# Altium project ECP5_V2.PrjPcb (part 1 of 2)
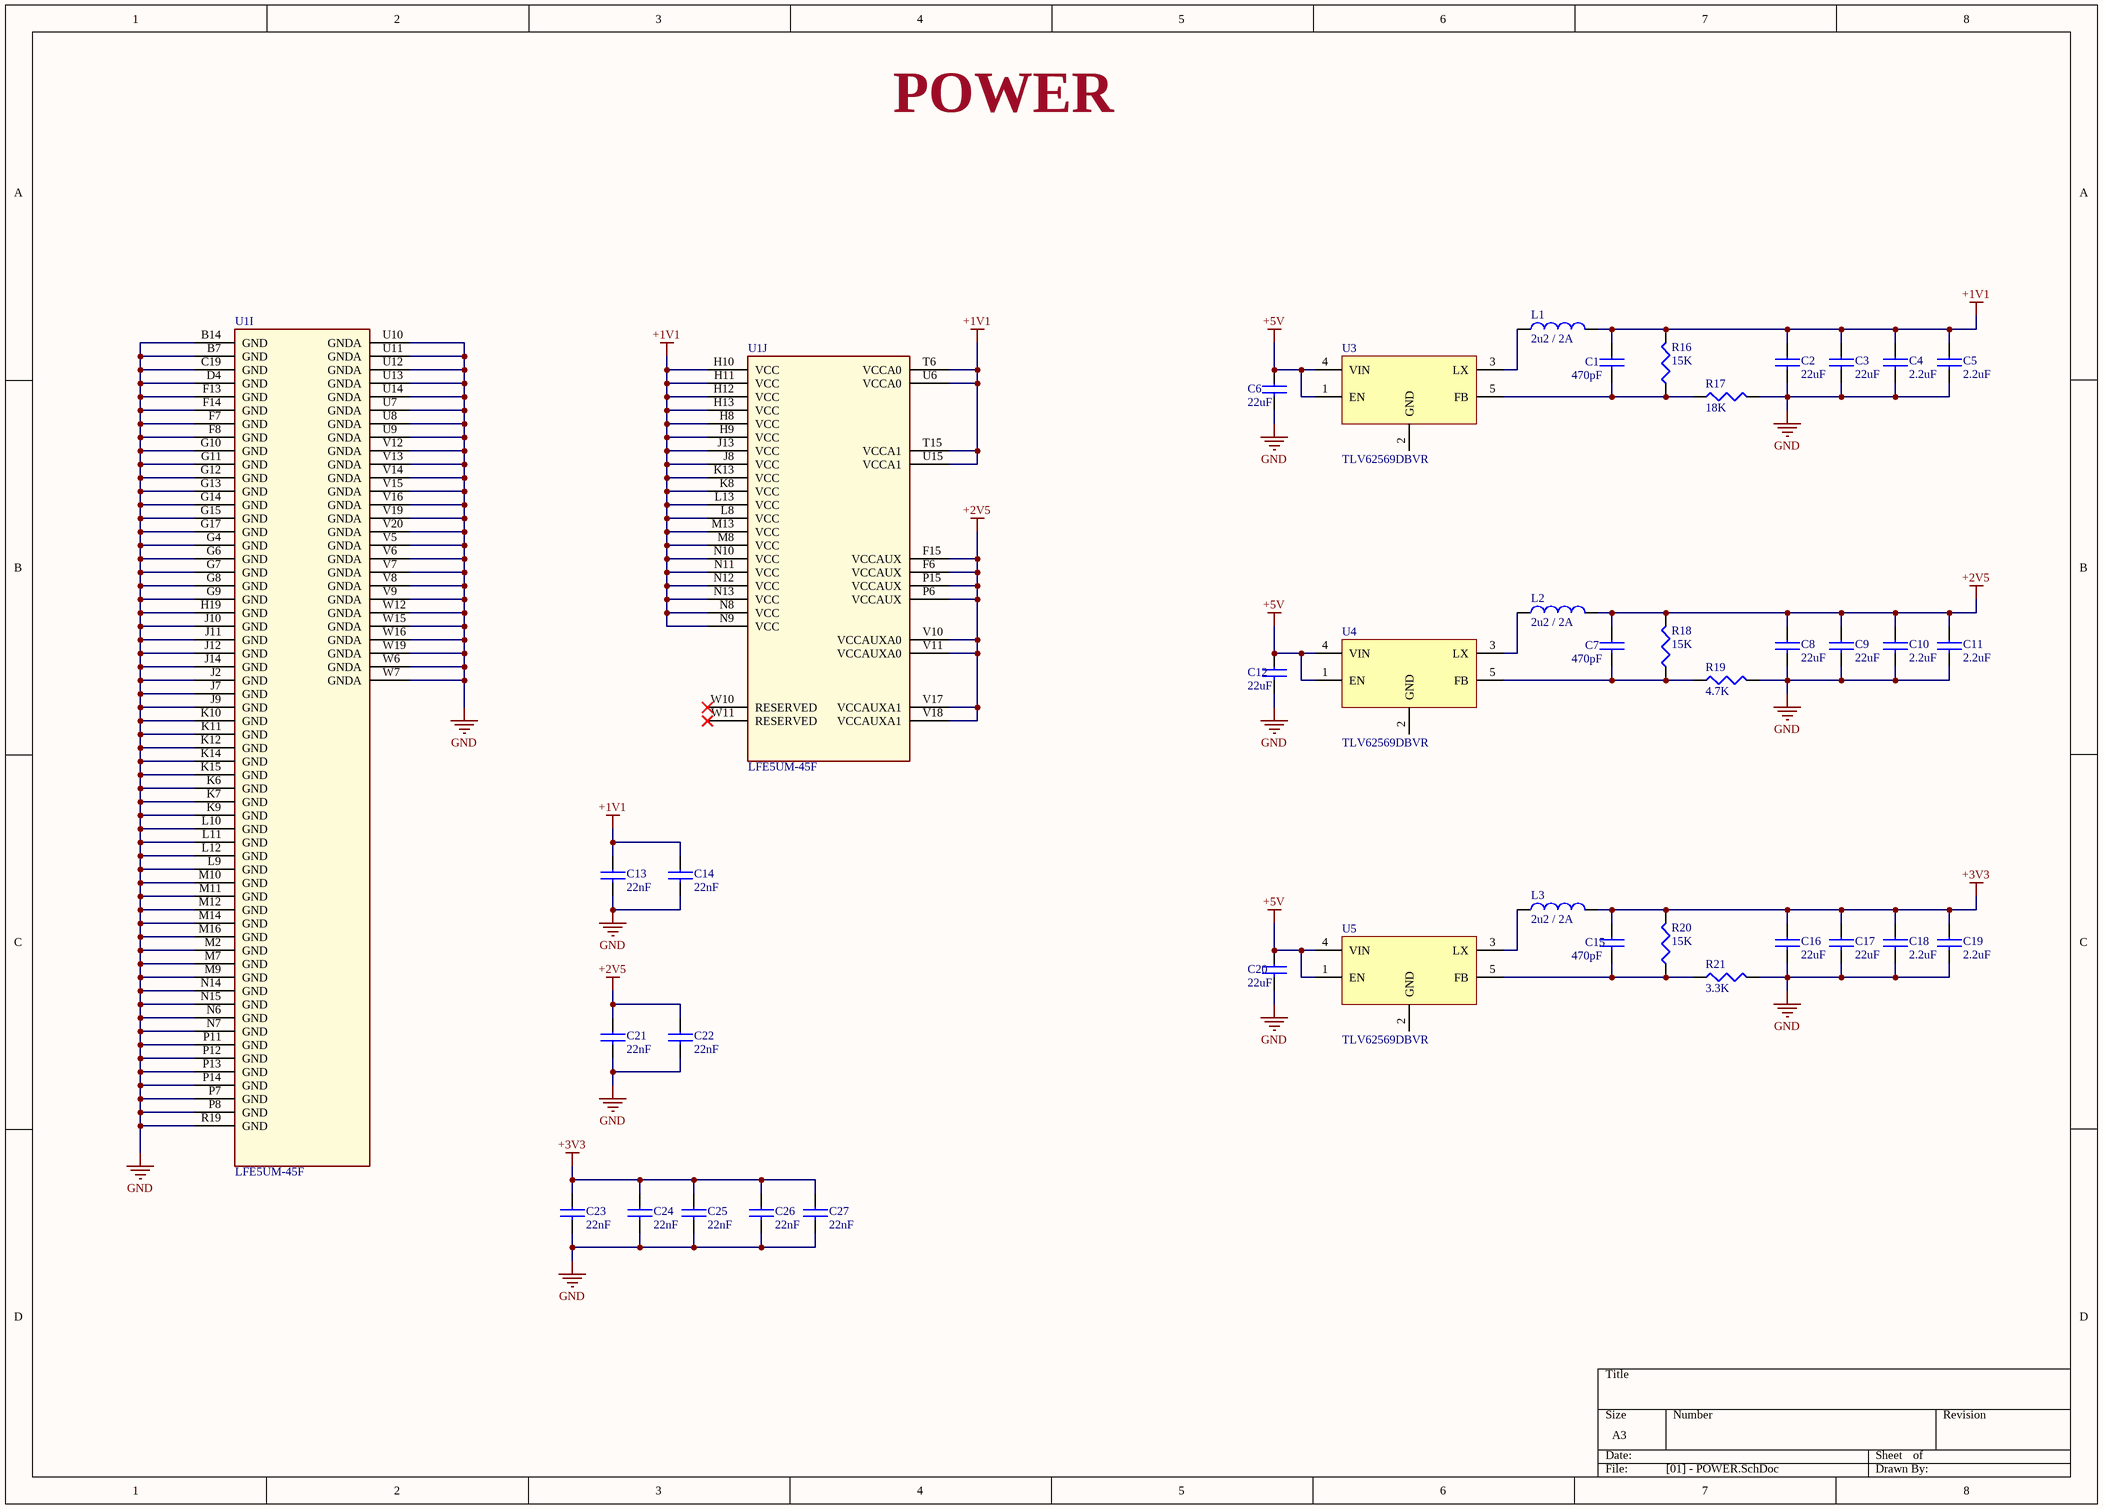
[diagram p0: [01] - POWER.SchDoc]
7 sheets, 98 parts. Net scope: global (net labels, ports and power ports of the same name join across sheets).
Board file: ECP5_V2.PcbDoc
Sheets:
  [01] - POWER.SchDoc
  [02] - USB.SchDoc
  [03] - SDCARD.SchDoc
  [04] - RAM.SchDoc
  [05] - FLASH.SchDoc
  [06] - GPIO.SchDoc
  [07] - UNUSED.SchDoc

## Sheet [01] - POWER.SchDoc
size A3

### Parts
C1  470pF  [C0603]
C2  22uF  [C0805]
C3  22uF  [C0805]
C4  2.2uF  [C0805]
C5  2.2uF  [C0805]
C6  22uF  [C0805]
C7  470pF  [C0603]
C8  22uF  [C0805]
C9  22uF  [C0805]
C10  2.2uF  [C0805]
C11  2.2uF  [C0805]
C12  22uF  [C0805]
C13  22nF  [C0603]
C14  22nF  [C0603]
C15  470pF  [C0603]
C16  22uF  [C0805]
C17  22uF  [C0805]
C18  2.2uF  [C0805]
C19  2.2uF  [C0805]
C20  22uF  [C0805]
C21  22nF  [C0603]
C22  22nF  [C0603]
C23  22nF  [C0603]
C24  22nF  [C0603]
C25  22nF  [C0603]
C26  22nF  [C0603]
C27  22nF  [C0603]
L1  2u2 / 2A  [C1210_IND]
L2  2u2 / 2A  [C1210_IND]
L3  2u2 / 2A  [C1210_IND]
R16  15K  [R0603]
R17  18K  [R0603]
R18  15K  [R0603]
R19  4.7K  [R0603]
R20  15K  [R0603]
R21  3.3K  [R0603]
U1  LFE5UM-45F  [LFE5BG381]  (parts I,J of 11)
U3  TLV62569DBVR  [SOT95P370X145-5N]
U4  TLV62569DBVR  [SOT95P370X145-5N]
U5  TLV62569DBVR  [SOT95P370X145-5N]

### Nets
+1V1: C1.1 C2.1 C3.1 C4.1 C5.1 C13.1 C14.1 L1.2 R16.2 U1.H8(VCC) U1.H9(VCC) U1.H10(VCC) U1.H11(VCC) U1.H12(VCC) U1.H13(VCC) U1.J8(VCC) U1.J13(VCC) U1.K8(VCC) U1.K13(VCC) U1.L8(VCC) U1.L13(VCC) U1.M8(VCC) U1.M13(VCC) U1.N8(VCC) U1.N9(VCC) U1.N10(VCC) U1.N11(VCC) U1.N12(VCC) U1.N13(VCC) U1.T6(VCCA0) U1.T15(VCCA1) U1.U6(VCCA0) U1.U15(VCCA1)
+2V5: C7.1 C8.1 C9.1 C10.1 C11.1 C21.1 C22.1 L2.2 R18.2 U1.F6(VCCAUX) U1.F15(VCCAUX) U1.P6(VCCAUX) U1.P15(VCCAUX) U1.V10(VCCAUXA0) U1.V11(VCCAUXA0) U1.V17(VCCAUXA1) U1.V18(VCCAUXA1)
+3V3: C15.1 C16.1 C17.1 C18.1 C19.1 C23.1 C24.1 C25.1 C26.1 C27.1 L3.2 R20.2
+5V: C6.1 C12.1 C20.1 U3.1(EN) U3.4(VIN) U4.1(EN) U4.4(VIN) U5.1(EN) U5.4(VIN)
GND: C2.2 C3.2 C4.2 C5.2 C6.2 C8.2 C9.2 C10.2 C11.2 C12.2 C13.2 C14.2 C16.2 C17.2 C18.2 C19.2 C20.2 C21.2 C22.2 C23.2 C24.2 C25.2 C26.2 C27.2 R17.2 R19.2 R21.2 U1.B7(GND) U1.B14(GND) U1.C19(GND) U1.D4(GND) U1.F7(GND) U1.F8(GND) U1.F13(GND) U1.F14(GND) U1.G4(GND) U1.G6(GND) U1.G7(GND) U1.G8(GND) U1.G9(GND) U1.G10(GND) U1.G11(GND) U1.G12(GND) U1.G13(GND) U1.G14(GND) U1.G15(GND) U1.G17(GND) U1.H19(GND) U1.J2(GND) U1.J7(GND) U1.J9(GND) U1.J10(GND) U1.J11(GND) U1.J12(GND) U1.J14(GND) U1.K6(GND) U1.K7(GND) U1.K9(GND) U1.K10(GND) U1.K11(GND) U1.K12(GND) U1.K14(GND) U1.K15(GND) U1.L9(GND) U1.L10(GND) U1.L11(GND) U1.L12(GND) U1.M2(GND) U1.M7(GND) U1.M9(GND) U1.M10(GND) U1.M11(GND) U1.M12(GND) U1.M14(GND) U1.M16(GND) U1.N6(GND) U1.N7(GND) U1.N14(GND) U1.N15(GND) U1.P7(GND) U1.P8(GND) U1.P11(GND) U1.P12(GND) U1.P13(GND) U1.P14(GND) U1.R19(GND) U1.U7(GNDA) U1.U8(GNDA) U1.U9(GNDA) U1.U10(GNDA) U1.U11(GNDA) U1.U12(GNDA) U1.U13(GNDA) U1.U14(GNDA) U1.V5(GNDA) U1.V6(GNDA) U1.V7(GNDA) U1.V8(GNDA) U1.V9(GNDA) U1.V12(GNDA) U1.V13(GNDA) U1.V14(GNDA) U1.V15(GNDA) U1.V16(GNDA) U1.V19(GNDA) U1.V20(GNDA) U1.W6(GNDA) U1.W7(GNDA) U1.W12(GNDA) U1.W15(GNDA) U1.W16(GNDA) U1.W19(GNDA)
NetC1_2: C1.2 R16.1 R17.1 U3.5(FB)
NetC7_2: C7.2 R18.1 R19.1 U4.5(FB)
NetC15_2: C15.2 R20.1 R21.1 U5.5(FB)
NetL1_1: L1.1 U3.3(LX)
NetL2_1: L2.1 U4.3(LX)
NetL3_1: L3.1 U5.3(LX)

Not connected (* = marked no-connect by the designer): U1 W10(RESERVED)* W11(RESERVED)*; U3 2(GND); U4 2(GND); U5 2(GND)

### Notes on the sheet
- POWER

### Library data of the parts
C1 C7 C15 = C0603C471K3RACTU: KEMET - C0603C471K3RACTU - SMD Multilayer Ceramic Capacitor, 470 pF, 25 V, 0603 [1608 Metric], ± 10%, X7R, C Series KEMET; Voltage Rating: 25V; Supplier 1: Digi-Key; Manufacturer: KEMET; Manufacturer Part Number: C0603C471K3RACTU; Stock 1: 28906; Pricing 1: 1=0.1, 10=0.067, 100=0.0298, 500=0.02126, 1000=0.0167 (USD); Mount: Surface Mount; Case/Package: 0603; Case Code (Metric): 1608; Case Code (Imperial): 0603; Dielectric Material: Ceramic; Min Operating Temperature: -55°C; Max Operating Temperature: 125°C; Package Quantity: 4000; Capacitance: 470pF; Tolerance: 10%; Packaging: Tape and Reel; Voltage Rating (DC): 25V; Dielectric: X7R; Termination: SMD/SMT; Length: 1.6mm; Height: 0.8mm; Width: 0.031inch; Thickness: 0.034inch; Lead Pitch: 0.7mm; Depth: 0.8mm; Radiation Hardening: No; REACH SVHC: No SVHC; ComponentLink1URL: http://www.farnell.com/datasheets/2064971.pdf?src-supplier=Element14; ComponentLink1Description: http://www.farnell.com/datasheets/2064971.pdf?src-supplier=Element14; ComponentLink2URL: http://www.farnell.com/datasheets/2746078.pdf?src-supplier=Farnell; ComponentLink2Description: http://www.farnell.com/datasheets/2746078.pdf?src-supplier=Farnell; ComponentLink3URL: https://api.kemet.com/component-edge/download/datasheet/C0603C471K3RACTU.pdf?src-supplier=Digi-Key; ComponentLink3Description: https://api.kemet.com/component-edge/download/datasheet/C0603C471K3RACTU.pdf?src-supplier=Digi-Key; ComponentLink4URL: http://components.arrow.com/part/dataview/2089229S9467247N7429?src-supplier=Arrow; ComponentLink4Description: http://components.arrow.com/part/dataview/2089229S9467247N7429?src-supplier=Arrow; ComponentLink5URL: http://www.mouser.com/ds/2/212/KEM_C1002_X7R_SMD-1102033.pdf?src-supplier=Mouser; ComponentLink5Description: http://www.mouser.com/ds/2/212/KEM_C1002_X7R_SMD-1102033.pdf?src-supplier=Mouser; ComponentLink6URL: http://www.farnell.com/datasheets/2746078.pdf?src-supplier=Newark; ComponentLink6Description: http://www.farnell.com/datasheets/2746078.pdf?src-supplier=Newark; ComponentLink7URL: http://components.arrow.com/part/dataview/0323_00323242?src-supplier=Arrow+Europe; ComponentLink7Description: http://components.arrow.com/part/dataview/0323_00323242?src-supplier=Arrow+Europe; Supplier Part Number 1: 399-9086-6-ND
C2 C3 C6 C8 C9 C12 C16 C17 C20 = CL21A226MQCLRNC: CAP CER 22UF 6.3V X5R 0805; Manufacturer: Samsung; Tolerance: 20%; Supplier 1: Digi-Key; Manufacturer Part Number: CL21A226MQCLRNC; Stock 1: 271195; Pricing 1: 1=0.36, 10=0.247, 100=0.1484, 500=0.11132, 1000=0.09401 (USD); Mount: Surface Mount; Case/Package: 0805; Case Code (Metric): 2012; Case Code (Imperial): 0805; Min Operating Temperature: -55°C; Max Operating Temperature: 85°C; Capacitance: 22uF; Dielectric: X5R; Package Quantity: 1; Packaging: Tape and Reel; Voltage Rating: 6.3V; Length: 2mm; Height: 0.85mm; Depth: 1.25mm; Width: 0.049inch; Thickness: 0.037inch; Radiation Hardening: No; Lead Free: Lead Free; ComponentLink1URL: http://www.samsungsem.com/kr/support/product-search/mlcc/CL21A226MQCLRNC.jsp?src-supplier=Digi-Key; ComponentLink1Description: http://www.samsungsem.com/kr/support/product-search/mlcc/CL21A226MQCLRNC.jsp?src-supplier=Digi-Key; Supplier Part Number 1: 1276-2413-6-ND
C4 C5 C10 C11 C18 C19 = CL21A225KAFNNNG: Ceramic capacitor SMD 0805 2.2 µF 25 V 10 %; Manufacturer: Samsung; Voltage Rating: 25V; Tolerance: 10%; Supplier 1: Digi-Key; Manufacturer Part Number: CL21A225KAFNNNG; Stock 1: 303381; Pricing 1: 1=0.15, 10=0.11, 100=0.0517, 500=0.03626, 1000=0.03002 (USD); Mount: Surface Mount; Case/Package: 0805; Case Code (Metric): 2012; Case Code (Imperial): 0805; Material: Ceramic; Min Operating Temperature: -55°C; Max Operating Temperature: 85°C; Package Quantity: 3000; Packaging: Tape and Reel; Capacitance: 2.2uF; Length: 0.079inch; Width: 0.049inch; Thickness: 0.053inch; ComponentLink1URL: http://www.samsungsem.com/global/support/library/product-catalog/__icsFiles/afieldfile/2014/11/13/MLCC.pdf?src-supplier=Digi-Key; ComponentLink1Description: http://www.samsungsem.com/global/support/library/product-catalog/__icsFiles/afieldfile/2014/11/13/MLCC.pdf?src-supplier=Digi-Key; ComponentLink2URL: https://produktinfo.conrad.com/datenblaetter/450000-474999/455579-da-01-en-VS_KONDENSATOR_0805.pdf?src-supplier=Conrad; ComponentLink2Description: https://produktinfo.conrad.com/datenblaetter/450000-474999/455579-da-01-en-VS_KONDENSATOR_0805.pdf?src-supplier=Conrad; Supplier Part Number 1: 1276-6458-6-ND
C13 C14 C21-C27 = CX0603MRX7R8BB223: Feed Through Capacitors 22nF X7R 20% 25V; Manufacturer: Yageo; Supplier 1: Digi-Key; Manufacturer Part Number: CX0603MRX7R8BB223; Stock 1: 11069; Pricing 1: 1=0.92, 10=0.676, 100=0.4636, 500=0.36702, 1000=0.30907 (USD); Mount: Surface Mount; Case/Package: 0603; Number of Pins: 2; Case Code (Metric): 1608; Case Code (Imperial): 0603; Min Operating Temperature: -55°C; Max Operating Temperature: 125°C; Capacitance: 22nF; Tolerance: 20%; Voltage Rating: 25V; Package Quantity: 1; Packaging: Tape and Reel; Voltage Rating (DC): 25V; Dielectric: X7R; Termination: SMD/SMT; Length: 0.063inch; Height: 0.65mm; Width: 0.034inch; Thickness: 0.03inch; REACH SVHC: No SVHC; Lead Free: Lead Free; ComponentLink1URL: http://www.yageo.com/NewPortal/_en/search/productDocs.jsp?YageoPartNumber=CX0603MRX7R8BB223&src-supplier=Digi-Key; ComponentLink1Description: http://www.yageo.com/NewPortal/_en/search/productDocs.jsp?YageoPartNumber=CX0603MRX7R8BB223&src-supplier=Digi-Key; Supplier Part Number 1: 311-1234-6-ND
L1-L3 = L1210R2R2MDWIT: FIXED IND 2.2UH 2A 80 MOHM SMD; Manufacturer: KEMET; Core Material: Ferrite; Tolerance: 20%; Shielding: Unshielded; Self Resonant Frequency: 190MHz; DC Resistance (DCR): 80mR; Test Frequency: 100kHz; DC Current: 1.13A; Supplier 1: Digi-Key; Manufacturer Part Number: L1210R2R2MDWIT; Stock 1: 2998; Pricing 1: 1=0.55, 10=0.479, 100=0.3421, 500=0.28738 (USD); Mount: Surface Mount; Case/Package: 1210; Case Code (Metric): 3225; Case Code (Imperial): 1210; Min Operating Temperature: -40°C; Max Operating Temperature: 105°C; Inductance: 2.2uH; Max DC Current: 2A; Package Quantity: 1000; Current Rating: 2A; Packaging: Tape and Reel; Inductance Tolerance: 20%; Composition: Wirewound,Ceramic; Termination: SMD/SMT; Military Standard: Not; Length: 0.126inch; Height: 2.5mm; Width: 0.098inch; Height - Seated (Max): 0.106inch; Depth: 2.7mm; Radiation Hardening: No; REACH SVHC: No SVHC; ComponentLink1URL: https://content.kemet.com/datasheets/F3115.pdf?src-supplier=Mouser; ComponentLink1Description: https://content.kemet.com/datasheets/F3115.pdf?src-supplier=Mouser; ComponentLink2URL: https://content.kemet.com/datasheets/F3115.pdf?src-supplier=Avnet+Europe; ComponentLink2Description: https://content.kemet.com/datasheets/F3115.pdf?src-supplier=Avnet+Europe; ComponentLink3URL: http://www.farnell.com/datasheets/27262.pdf?src-supplier=Element14; ComponentLink3Description: http://www.farnell.com/datasheets/27262.pdf?src-supplier=Element14; ComponentLink4URL: https://api.kemet.com/component-edge/download/datasheet/L1210R2R2MDWIT.pdf?src-supplier=Digi-Key; ComponentLink4Description: https://api.kemet.com/component-edge/download/datasheet/L1210R2R2MDWIT.pdf?src-supplier=Digi-Key; ComponentLink5URL: http://www.kemet.com/Lists/ProductCatalog/Attachments/57/F3115.pdf?src-supplier=Avnet; ComponentLink5Description: http://www.kemet.com/Lists/ProductCatalog/Attachments/57/F3115.pdf?src-supplier=Avnet; Supplier Part Number 1: 399-9598-6-ND
R16 R18 R20 = RC0603FR-0715KL: Res Thick Film 0603 15K Ohm 1% 1/10W ?100ppm/?C Molded SMD Paper T/R; Manufacturer: Yageo; Temperature Coefficient: 100ppm/°C; Resistance: 15kR; Power Rating: 100mW; Voltage Rating (DC): 50V; Supplier 1: Digi-Key; Manufacturer Part Number: RC0603FR-0715KL; Stock 1: 3342455; Pricing 1: 1=0.1, 10=0.023, 100=0.0094, 1000=0.00421, 2500=0.00366 (USD); Case/Package: 0603; Number of Pins: 2; Case Code (Metric): 1608; Case Code (Imperial): 0603; Min Operating Temperature: -55°C; Max Operating Temperature: 155°C; Tolerance: 1%; Composition: Thick Film; Packaging: Tape and Reel; Package Quantity: 1; Voltage Rating: 50V; Number of Terminations: 2; Termination: SMD/SMT; Military Standard: Not; Max Power Dissipation: 100mW; Features: Moisture Resistant; Length: 1.6mm; Height: 0.022inch; Width: 0.031inch; Depth: 0.8mm; Lead Free: Lead Free; REACH SVHC: Unknown; ComponentLink1URL: http://www.yageo.com/documents/recent/PYu-RC_Group_51_RoHS_L_10.pdf?src-supplier=Digi-Key; ComponentLink1Description: http://www.yageo.com/documents/recent/PYu-RC_Group_51_RoHS_L_10.pdf?src-supplier=Digi-Key; ComponentLink2URL: http://www.yageo.com/documents/recent/PYu-RC_Group_51_RoHS_L_9.pdf?src-supplier=Digi-Key; ComponentLink2Description: http://www.yageo.com/documents/recent/PYu-RC_Group_51_RoHS_L_9.pdf?src-supplier=Digi-Key; ComponentLink3URL: https://www.verical.com/server-webapp/html/getDatasheet?partID=327895&src-supplier=Verical; ComponentLink3Description: https://www.verical.com/server-webapp/html/getDatasheet?partID=327895&src-supplier=Verical; Supplier Part Number 1: 311-15.0KHRCT-ND
R17 = RC0603FR-0718KL: YAGEO (PHYCOMP) - RC0603FR-0718KL - SMD Chip Resistor, 0603 [1608 Metric], 18 kohm, RC Series, 75 V, Thick Film, 100 mW; Resistance: 18kR; Power Rating: 100mW; Tolerance: 1%; Voltage Rating: 75V; Voltage Rating (DC): 50V; Temperature Coefficient: 100ppm/°C; Supplier 1: Digi-Key; Manufacturer: Yageo; Manufacturer Part Number: RC0603FR-0718KL; Stock 1: 0; Pricing 1: 1=0.1, 10=0.023, 100=0.0094, 1000=0.00421, 2500=0.00366 (USD); Case/Package: 0603; Number of Pins: 2; Weight: 7.1E-05oz; Case Code (Imperial): 0603; Case Code (Metric): 1608; Min Operating Temperature: -55°C; Max Operating Temperature: 155°C; Composition: Thick Film; Packaging: Tape and Reel; Termination: SMD/SMT; Military Standard: Not; Length: 1.6mm; Height: 0.45mm; Width: 0.8mm; Depth: 0.8mm; REACH SVHC: Unknown; Lead Free: Lead Free; ComponentLink1URL: http://documents.rs-components.com/techlib://itc_doclist_GB.htm?stockno=5049959&src-supplier=RSComponents; ComponentLink1Description: http://documents.rs-components.com/techlib://itc_doclist_GB.htm?stockno=5049959&src-supplier=RSComponents; ComponentLink2URL: https://www.verical.com/server-webapp/html/getDatasheet?partID=325162&src-supplier=Verical; ComponentLink2Description: https://www.verical.com/server-webapp/html/getDatasheet?partID=325162&src-supplier=Verical; ComponentLink3URL: http://www.farnell.com/datasheets/2167052.pdf?src-supplier=Element14; ComponentLink3Description: http://www.farnell.com/datasheets/2167052.pdf?src-supplier=Element14; ComponentLink4URL: http://www.farnell.com/datasheets/1868787.pdf?src-supplier=Element14; ComponentLink4Description: http://www.farnell.com/datasheets/1868787.pdf?src-supplier=Element14; Supplier Part Number 1: 311-18.0KHRDKR-ND
R19 = RC0603FR-074K7L: RES SMD 4.7K OHM 1% 1/10W 0603; Manufacturer: Yageo; Resistance: 4.7kR; Temperature Coefficient: 100ppm/°C; Power Rating: 100mW; Voltage Rating (DC): 50V; Supplier 1: Digi-Key; Manufacturer Part Number: RC0603FR-074K7L; Stock 1: 1446473; Pricing 1: 1=0.1, 10=0.023, 100=0.0094, 1000=0.00421, 2500=0.00366 (USD); Case/Package: 0603; Number of Pins: 2; Case Code (Imperial): 0603; Case Code (Metric): 1608; Min Operating Temperature: -55°C; Max Operating Temperature: 155°C; Tolerance: 1%; Composition: Thick Film; Packaging: Tape and Reel; Voltage Rating: 50V; Termination: SMD/SMT; Military Standard: Not; Length: 1.6mm; Height: 0.45mm; Width: 0.8mm; Depth: 0.8mm; Lead Pitch: 0.3mm; REACH SVHC: No SVHC; Lead Free: Lead Free; ComponentLink1URL: https://www.verical.com/server-webapp/html/getDatasheet?partID=422754&src-supplier=Verical; ComponentLink1Description: https://www.verical.com/server-webapp/html/getDatasheet?partID=422754&src-supplier=Verical; ComponentLink2URL: http://www.farnell.com/datasheets/2167052.pdf?src-supplier=Element14; ComponentLink2Description: http://www.farnell.com/datasheets/2167052.pdf?src-supplier=Element14; ComponentLink3URL: http://www.farnell.com/datasheets/38590.pdf?src-supplier=Element14; ComponentLink3Description: http://www.farnell.com/datasheets/38590.pdf?src-supplier=Element14; ComponentLink4URL: http://www.farnell.com/datasheets/1868787.pdf?src-supplier=Element14; ComponentLink4Description: http://www.farnell.com/datasheets/1868787.pdf?src-supplier=Element14; Supplier Part Number 1: 311-4.70KHRCT-ND
R21 = RC0603FR-073K3L: YAGEO - RC0603FR-073K3L - SMD Chip Resistor, 0603 [1608 Metric], 3.3 kohm, RC Series, 75 V, Thick Film, 100 mW; Resistance: 3.3kR; Tolerance: 1%; Temperature Coefficient: 100ppm/°C; Voltage Rating (DC): 50V; Power Rating: 100mW; Supplier 1: Digi-Key; Manufacturer: Yageo; Manufacturer Part Number: RC0603FR-073K3L; Stock 1: 1337597; Pricing 1: 1=0.1, 10=0.023, 100=0.0094, 1000=0.00421, 2500=0.00366 (USD); Case/Package: 0603; Number of Pins: 2; Case Code (Imperial): 0603; Case Code (Metric): 1608; Min Operating Temperature: -55°C; Max Operating Temperature: 155°C; Packaging: Tape and Reel; Composition: Thick Film; Voltage Rating: 50V; Package Quantity: 1; Termination: SMD/SMT; Number of Terminations: 2; Military Standard: Not; Max Power Dissipation: 100mW; Features: Moisture Resistant; Length: 1.6mm; Height: 0.45mm; Width: 0.8mm; Depth: 0.8mm; REACH SVHC: No SVHC; Lead Free: Lead Free; ComponentLink1URL: http://www.yageo.com/documents/recent/PYu-RC_Group_51_RoHS_L_10.pdf?src-supplier=Digi-Key; ComponentLink1Description: http://www.yageo.com/documents/recent/PYu-RC_Group_51_RoHS_L_10.pdf?src-supplier=Digi-Key; ComponentLink2URL: http://www.farnell.com/datasheets/2167052.pdf?src-supplier=Element14; ComponentLink2Description: http://www.farnell.com/datasheets/2167052.pdf?src-supplier=Element14; ComponentLink3URL: http://www.farnell.com/datasheets/1686128.pdf?src-supplier=Element14; ComponentLink3Description: http://www.farnell.com/datasheets/1686128.pdf?src-supplier=Element14; ComponentLink4URL: http://www.farnell.com/datasheets/1868787.pdf?src-supplier=Element14; ComponentLink4Description: http://www.farnell.com/datasheets/1868787.pdf?src-supplier=Element14; Supplier Part Number 1: 311-3.30KHRDKR-ND
U1 = LFE5UM-45F-6BG381C: ECP5 Series 44 K LUTs 203 I/O 1.1 V Slow Surface Mount FPGA - CABGA-381; Manufacturer: Lattice Semiconductor; Number of Logic Blocks (LABs): 11000; Number of Logic Elements/Cells: 44000; RAM Size: 1990656b; Number of I/Os: 203; Supplier 1: Digi-Key; Manufacturer Part Number: LFE5UM-45F-6BG381C; Stock 1: 0; Pricing 1: 90=19.13967 (USD); Mount: Surface Mount; Case/Package: FBGA; Min Operating Temperature: 0°C; Max Operating Temperature: 85°C; Lead Free: Lead Free; ComponentLink1URL: http://www.latticesemi.com/~/media/LatticeSemi/Documents/DataSheets/ECP5/DS1044.pdf?src-supplier=Digi-Key; ComponentLink1Description: http://www.latticesemi.com/~/media/LatticeSemi/Documents/DataSheets/ECP5/DS1044.pdf?src-supplier=Digi-Key; Supplier Part Number 1: 220-1994-ND
U3-U5 = TLV62569DBVR: 1-A HIGH EFFICIENCY STEP-DOWN; Manufacturer: Texas Instruments; Output Type: Adjustable; Output Configuration: Positive; Min Input Voltage: 2.5V; Max Input Voltage: 5.5V; Min Output Voltage: 600mV; Output Current: 2A; Switching Frequency: 1.5MHz; Synchronous Rectifier: Yes; Supplier 1: Digi-Key; Manufacturer Part Number: TLV62569DBVR; Stock 1: 2680; Pricing 1: 1=0.53, 10=0.454, 25=0.4236, 100=0.3146, 250=0.2662, 500=0.2541, 1000=0.18755 (USD); Mount: Surface Mount; Case/Package: SOT-23-5; Min Operating Temperature: -40°C; Max Operating Temperature: 125°C; Packaging: Cut Tape; Max Output Voltage: 5.5V; ComponentLink1URL: http://www.ti.com/lit/ds/symlink/tlv62569.pdf?src-supplier=Farnell; ComponentLink1Description: http://www.ti.com/lit/ds/symlink/tlv62569.pdf?src-supplier=Farnell; ComponentLink2URL: http://www.ti.com/lit/ds/symlink/tlv62569.pdf?src-supplier=Digi-Key; ComponentLink2Description: http://www.ti.com/lit/ds/symlink/tlv62569.pdf?src-supplier=Digi-Key; Supplier Part Number 1: 296-47360-6-ND

## Sheet [02] - USB.SchDoc
size A3
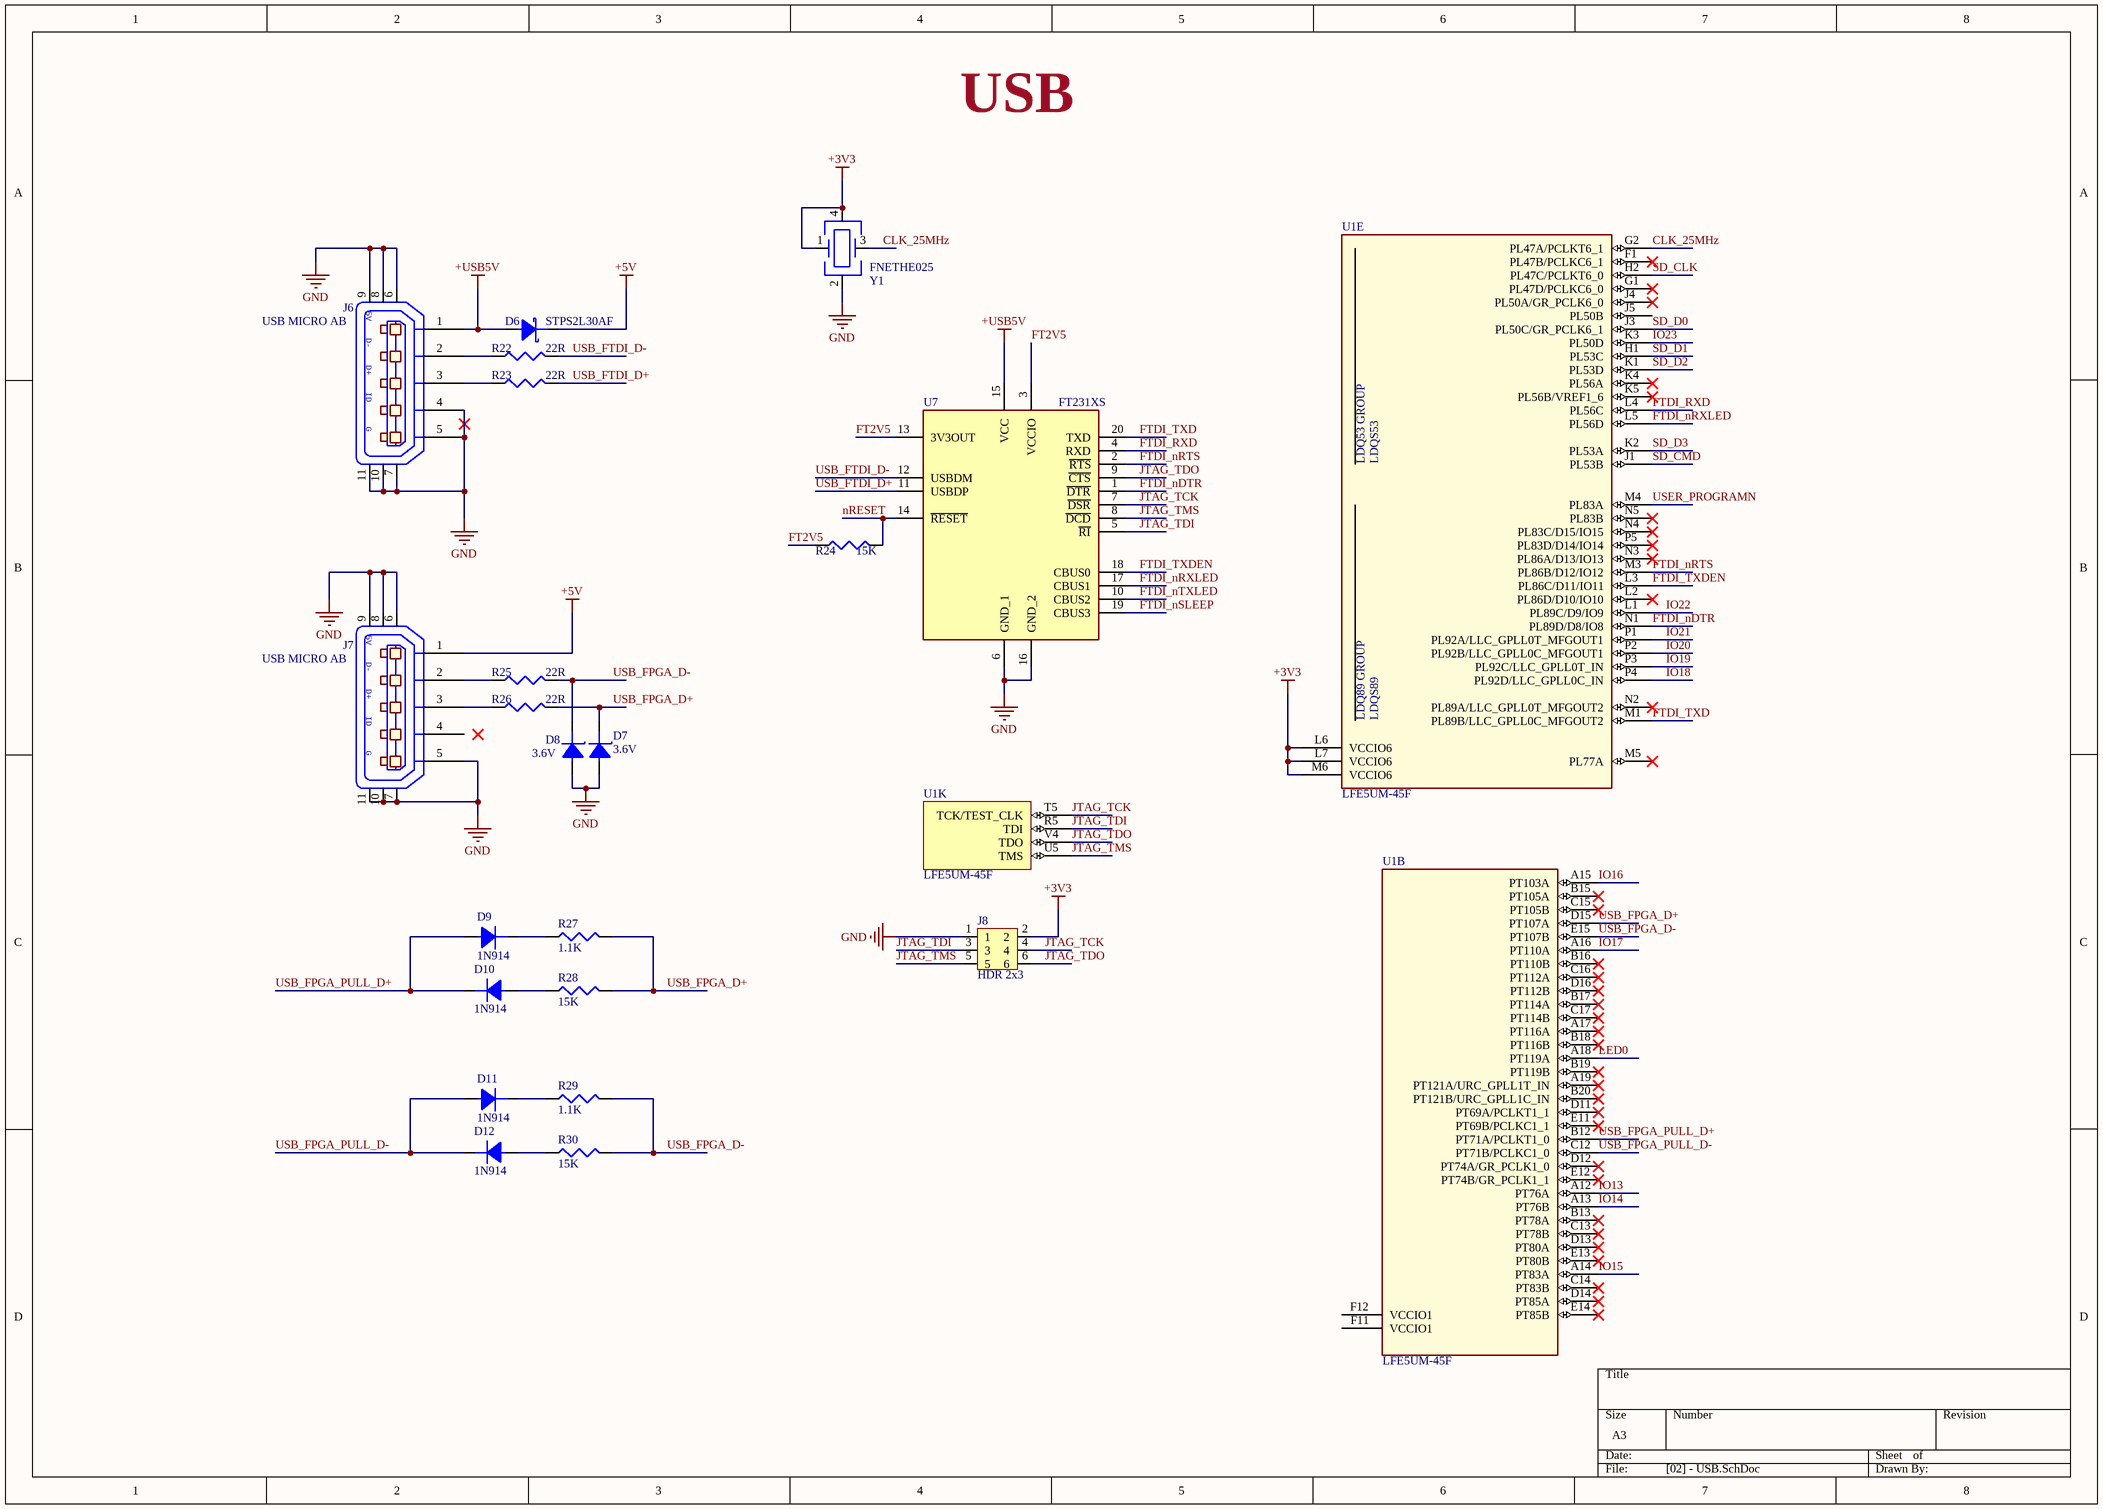
[diagram p1: [02] - USB.SchDoc]

### Parts
D6  STPS2L30AF  [SMA]
D7  3.6V  [SOD323]
D8  3.6V  [SOD323]
D9  1N914  [SOD323]
D10  1N914  [SOD323]
D11  1N914  [SOD323]
D12  1N914  [SOD323]
J6  USB MICRO AB  [USB_Micro_AB]
J7  USB MICRO AB  [USB_Micro_AB]
J8  HDR 2x3  [HDR_2x3_2.54MM]
R22  22R  [R0603]
R23  22R  [R0603]
R24  15K  [R0603]
R25  22R  [R0603]
R26  22R  [R0603]
R27  1.1K  [R0603]
R28  15K  [R0603]
R29  1.1K  [R0603]
R30  15K  [R0603]
U1  LFE5UM-45F  [LFE5BG381]  (parts B,E,K of 11)
U7  FT231XS  [SOP64P599X175-20N]
Y1  FNETHE025  [TSOP440P690X140-4N]

### Nets
+3V3: J8.2 U1.L6(VCCIO6) U1.L7(VCCIO6) U1.M6(VCCIO6) Y1.1 Y1.4
+5V: D6.1(Cathode) J7.1(P1)
+USB5V: D6.2(Anode) J6.1(P1) U7.15(VCC)
GND: D7.2(Anode) D8.2(Anode) J6.4(P4) J6.5(P5) J6.6 J6.7 J6.8 J6.9 J6.10 J6.11 J7.5(P5) J7.6 J7.7 J7.8 J7.9 J7.10 J7.11 J8.1 U7.6(GND_1) U7.16(GND_2) Y1.2
CLK_25MHz: U1.G2(PL47A/PCLKT6_1) Y1.3
FT2V5: R24.1 U7.3(VCCIO) U7.13(3V3OUT)
FTDI_nDTR: U1.N1(PL89D/D8/IO8) U7.1(~{DTR})
FTDI_nRTS: U1.M3(PL86B/D12/IO12) U7.2(~{RTS})
FTDI_nRXLED: U1.L5(PL56D) U7.17(CBUS1)
FTDI_nSLEEP: U7.19(CBUS3)
FTDI_nTXLED: U7.10(CBUS2)
FTDI_RXD: U1.L4(PL56C) U7.4(RXD)
FTDI_TXD: U1.M1(PL89B/LLC_GPLL0C_MFGOUT2) U7.20(TXD)
FTDI_TXDEN: U1.L3(PL86C/D11/IO11) U7.18(CBUS0)
IO13: U1.A12(PT76A)
IO14: U1.A13(PT76B)
IO15: U1.A14(PT83A)
IO16: U1.A15(PT103A)
IO17: U1.A16(PT110A)
IO18: U1.P4(PL92D/LLC_GPLL0C_IN)
IO19: U1.P3(PL92C/LLC_GPLL0T_IN)
IO20: U1.P2(PL92B/LLC_GPLL0C_MFGOUT1)
IO21: U1.P1(PL92A/LLC_GPLL0T_MFGOUT1)
IO22: U1.L1(PL89C/D9/IO9)
IO23: U1.K3(PL50D)
JTAG_TCK: J8.4 U1.T5(TCK/TEST_CLK) U7.7(~{DSR})
JTAG_TDI: J8.3 U1.R5(TDI) U7.5(~{RI})
JTAG_TDO: J8.6 U1.V4(TDO) U7.9(~{CTS})
JTAG_TMS: J8.5 U1.U5(TMS) U7.8(~{DCD})
LED0: U1.A18(PT119A)
nRESET: R24.2 U7.14(~{RESET})
SD_CLK: U1.H2(PL47C/PCLKT6_0)
SD_CMD: U1.J1(PL53B)
SD_D0: U1.J3(PL50C/GR_PCLK6_1)
SD_D1: U1.H1(PL53C)
SD_D2: U1.K1(PL53D)
SD_D3: U1.K2(PL53A)
USB_FPGA_D+: D7.1(Cathode) R26.2 R27.2 R28.2 U1.D15(PT107A)
USB_FPGA_D-: D8.1(Cathode) R25.2 R29.2 R30.2 U1.E15(PT107B)
USB_FPGA_PULL_D+: D9.2(Anode) D10.1(Cathode) U1.B12(PT71A/PCLKT1_0)
USB_FPGA_PULL_D-: D11.2(Anode) D12.1(Cathode) U1.C12(PT71B/PCLKC1_0)
USB_FTDI_D+: R23.2 U7.11(USBDP)
USB_FTDI_D-: R22.2 U7.12(USBDM)
USER_PROGRAMN: U1.M4(PL83A)
NetD9_1: D9.1(Cathode) R27.1
NetD10_2: D10.2(Anode) R28.1
NetD11_1: D11.1(Cathode) R29.1
NetD12_2: D12.2(Anode) R30.1
NetJ6_2: J6.2(P2) R22.1
NetJ6_3: J6.3(P3) R23.1
NetJ7_2: J7.2(P2) R25.1
NetJ7_3: J7.3(P3) R26.1

Not connected (* = marked no-connect by the designer): J7 4(P4); U1 A17(PT116A)* A19(PT121A/URC_GPLL1T_IN)* B13(PT78A)* B15(PT105A)* B16(PT110B)* B17(PT114A)* B18(PT116B)* B19(PT119B)* B20(PT121B/URC_GPLL1C_IN)* C13(PT78B)* C14(PT83B)* C15(PT105B)* C16(PT112A)* C17(PT114B)* D11(PT69A/PCLKT1_1)* D12(PT74A/GR_PCLK1_0)* D13(PT80A)* D14(PT85A)* D16(PT112B)* E11(PT69B/PCLKC1_1)* E12(PT74B/GR_PCLK1_1)* E13(PT80B)* E14(PT85B)* F1(PL47B/PCLKC6_1)* F11(VCCIO1) F12(VCCIO1) G1(PL47D/PCLKC6_0)* J4(PL50A/GR_PCLK6_0)* J5(PL50B) K4(PL56A)* K5(PL56B/VREF1_6)* L2(PL86D/D10/IO10)* M5(PL77A)* N2(PL89A/LLC_GPLL0T_MFGOUT2)* N3(PL86A/D13/IO13)* N4(PL83C/D15/IO15)* N5(PL83B)* P5(PL83D/D14/IO14)*

### Notes on the sheet
- USB
- (in symbol 0475890001) 5V; D-; D+; ID; G
- (in symbol LFE5UM-45F-6BG381C, part E) LDQ53 GROUP; LDQS53; LDQ89 GROUP; LDQS89

### Library data of the parts
D6 = STPS2L30AF: DIODE SCHOTTKY 30V 2A SMA; Manufacturer: STMicroelectronics; Forward Voltage: 530mV; Peak Reverse Current: 200uA; Max Surge Current: 75A; Element Configuration: Single; Supplier 1: Digi-Key; Manufacturer Part Number: STPS2L30AF; Stock 1: 8523; Pricing 1: 1=0.45, 10=0.386, 25=0.3604, 100=0.2678, 250=0.2544, 500=0.2091, 1000=0.16995, 2500=0.15965, 5000=0.1442 (USD); Mount: Surface Mount; Case/Package: SMA; Number of Pins: 2; Min Operating Temperature: -65°C; Max Operating Temperature: 150°C; Package Quantity: 1; Packaging: Tape and Reel; Forward Current: 2A; Average Rectified Current: 2A; Max Reverse Leakage Current: 200uA; Max Repetitive Reverse Voltage (Vrrm): 30V; Peak Non-Repetitive Surge Current: 75A; Max Forward Surge Current (Ifsm): 75A; Max Reverse Voltage (DC): 30V; Radiation Hardening: No; REACH SVHC: No SVHC; Lead Free: Lead Free; ComponentLink1URL: http://www.st.com/content/ccc/resource/technical/document/datasheet/62/6b/2e/7f/34/cb/43/55/CD00001633.pdf/files/CD00001633.pdf/jcr:content/translations/en.CD00001633.pdf?src-supplier=Digi-Key; ComponentLink1Description: http://www.st.com/content/ccc/resource/technical/document/datasheet/62/6b/2e/7f/34/cb/43/55/CD00001633.pdf/files/CD00001633.pdf/jcr:content/translations/en.CD00001633.pdf?src-supplier=Digi-Key; ComponentLink2URL: http://www.st.com/st-web-ui/static/active/en/resource/technical/document/datasheet/CD00001633.pdf?src-supplier=Future+Electronics; ComponentLink2Description: http://www.st.com/st-web-ui/static/active/en/resource/technical/document/datasheet/CD00001633.pdf?src-supplier=Future+Electronics; ComponentLink3URL: http://www.st.com/st-web-ui/static/active/en/resource/technical/document/datasheet/CD00001633.pdf?src-supplier=Mouser; ComponentLink3Description: http://www.st.com/st-web-ui/static/active/en/resource/technical/document/datasheet/CD00001633.pdf?src-supplier=Mouser; Supplier Part Number 1: 497-12310-6-ND
D7 D8 = BZT52C3V6S-TP: Diode Zener Single 3.6V 5% 200mW 2-Pin SOD-323 T/R; Manufacturer: MCC; Tolerance: 6%; Impedance: 90R; Max Reverse Leakage Current: 15uA; Test Current: 5mA; Supplier 1: Digi-Key; Manufacturer Part Number: BZT52C3V6S-TP; Stock 1: 5023; Pricing 1: 1=0.26, 10=0.215, 25=0.18, 100=0.088, 250=0.0866, 500=0.0734, 1000=0.051 (USD); Mount: Surface Mount; Number of Pins: 2; Min Operating Temperature: -65°C; Max Operating Temperature: 175°C; Package Quantity: 3000; Packaging: Tape and Reel; Zener Voltage: 3.6V; Max Power Dissipation: 200mW; Power Dissipation: 200mW; Voltage Tolerance: 5%; Element Configuration: Single; Power Rating: 200mW; Voltage Rating (DC): 3.6V; Lead Free: Lead Free; ComponentLink1URL: http://www.mccsemi.com/up_pdf/BZT52C2V4S~BZT52C39S(200mW)(SOD323).pdf?src-supplier=Digi-Key; ComponentLink1Description: http://www.mccsemi.com/up_pdf/BZT52C2V4S~BZT52C39S(200mW)(SOD323).pdf?src-supplier=Digi-Key; ComponentLink2URL: http://www.mouser.com/ds/2/258/BZT52C2V4S~BZT52C39S(200mW)(SOD323)-479732.pdf?src-supplier=Mouser; ComponentLink2Description: http://www.mouser.com/ds/2/258/BZT52C2V4S~BZT52C39S(200mW)(SOD323)-479732.pdf?src-supplier=Mouser; ComponentLink3URL: http://components.arrow.com/part/dataview/45991456S304003N2022?src-supplier=Arrow; ComponentLink3Description: http://components.arrow.com/part/dataview/45991456S304003N2022?src-supplier=Arrow; Supplier Part Number 1: BZT52C3V6S-TPMSDKR-ND
D9-D12 = 1N914BWS: ON SEMICONDUCTOR/FAIRCHILD - 1N914BWS. - SMALL SIGNAL DIODE; Forward Current: 150mA; Peak Reverse Current: 5uA; Max Repetitive Reverse Voltage (Vrrm): 75V; Element Configuration: Single; Forward Voltage: 1V; Power Dissipation: 200mW; Reverse Recovery Time: 4ns; Max Forward Surge Current (Ifsm): 4A; Supplier 1: Digi-Key; Manufacturer: ON Semiconductor / Fairchild; Manufacturer Part Number: 1N914BWS; Stock 1: 133438; Pricing 1: 1=0.16, 10=0.147, 25=0.14, 100=0.0616, 250=0.05912, 500=0.04838, 1000=0.0336 (USD); Mount: Surface Mount; Number of Pins: 2; Weight: 0.0276g; Contact Plating: Tin,Matte; Min Operating Temperature: -55°C; Max Operating Temperature: 150°C; Packaging: Tape and Reel; Package Quantity: 1; Average Rectified Current: 150mA; Max Reverse Voltage (DC): 75V; Reverse Voltage: 75V; Recovery Time: 4ns; Length: 1.8mm; Height: 1mm; Width: 1.35mm; Radiation Hardening: No; Lead Free: Lead Free; REACH SVHC: No SVHC; ComponentLink1URL: https://www.fairchildsemi.com/datasheets/1N/1N4148WS.pdf?src-supplier=Digi-Key; ComponentLink1Description: https://www.fairchildsemi.com/datasheets/1N/1N4148WS.pdf?src-supplier=Digi-Key; ComponentLink2URL: https://www.onsemi.com/pub/Collateral/1N914BWS-D.pdf?src-supplier=Digi-Key; ComponentLink2Description: https://www.onsemi.com/pub/Collateral/1N914BWS-D.pdf?src-supplier=Digi-Key; ComponentLink3URL: http://www.fairchildsemi.com/ds/1N/1N914BWS.pdf?src-supplier=Future+Electronics; ComponentLink3Description: http://www.fairchildsemi.com/ds/1N/1N914BWS.pdf?src-supplier=Future+Electronics; ComponentLink4URL: http://www.farnell.com/datasheets/1771770.pdf?src-supplier=Element14; ComponentLink4Description: http://www.farnell.com/datasheets/1771770.pdf?src-supplier=Element14; ComponentLink5URL: https://www.fairchildsemi.com/datasheets/1N/1N914BWS.pdf?src-supplier=Avnet; ComponentLink5Description: https://www.fairchildsemi.com/datasheets/1N/1N914BWS.pdf?src-supplier=Avnet; ComponentLink6URL: http://www.fairchildsemi.com/ds/1N/1N914BWS.pdf?src-supplier=Avnet+Europe; ComponentLink6Description: http://www.fairchildsemi.com/ds/1N/1N914BWS.pdf?src-supplier=Avnet+Europe; Supplier Part Number 1: 1N914BWSDKR-ND
J6 J7 = 0475890001: CONN RCPT MICRO USB AB R/A SMD; Manufacturer: Molex Inc; Connector Type: USB - micro AB; Number of Contacts: 5; Gender: Receptacle; .Creator: MM; Supplier 1: Digi-Key; Manufacturer Part Number: 0475890001; RoHS: RoHS Compliant; Category: Connectors, Interconnects; Stock 1: 12754; Pricing 1: 1=0.81, 10=0.764, 25=0.6872, 50=0.6108, 100=0.5854, 250=0.53452, 500=0.50908 (USD); Packaging: Cut Tape (CT); Specifications: -; Mounting Type: Surface Mount, Right Angle, Horizontal; Features: Board Guide, Shielded; Ingress Protection: -; ComponentLink1URL: http://www.molex.com/pdm_docs/sd/475890001_sd.pdf; ComponentLink1Description: http://www.molex.com/pdm_docs/sd/475890001_sd.pdf; Supplier Part Number 1: WM17143CT-ND; .Checked PCB: MM; .Checked SCH: MM
J8 = 67997-106HLF: CONN HEADER VERT 6POS 2.54MM; Manufacturer: Amphenol FCI; Number of Contacts: 6; Current Rating: 3A; Voltage Rating: 1.5kV; Insulation Resistance: 5GR; Gender: Male; Connector Type: Male Pin; Row Spacing: 0.1inch; Contact Post Length: 3.05mm; Supplier 1: Digi-Key; Manufacturer Part Number: 67997-106HLF; Stock 1: 906; Pricing 1: 1=1.73, 10=1.568, 100=1.3436, 500=1.11966, 1000=0.9597, 5000=0.85093, 10000=0.83174 (USD); Mount: Through Hole; Contact Plating: Gold,GXT; Contact Material: Bronze; Color: Black; Housing Color: Black; Housing Material: Thermoplastic; Min Operating Temperature: -65°C; Max Operating Temperature: 125°C; Number of Rows: 2; Termination: Through Hole; Packaging: Bulk; Package Quantity: 100; Contact Gender: Male; Number of Positions: 6; Max Voltage Rating (AC): 1.5kV; Orientation: Straight; Length: 7.62mm; Pitch: 2.54mm; Contact Mating Length: 0.23inch; Depth: 4.83mm; Radiation Hardening: No; REACH SVHC: No SVHC; Lead Free: Lead Free; Flammability Rating: UL94 V-0; ComponentLink1URL: https://cdn.amphenol-icc.com/media/wysiwyg/files/drawing/67996.pdf?src-supplier=Avnet; ComponentLink1Description: https://cdn.amphenol-icc.com/media/wysiwyg/files/drawing/67996.pdf?src-supplier=Avnet; ComponentLink2URL: https://cdn.amphenol-icc.com/media/wysiwyg/files/drawing/67996.pdf?src-supplier=Digi-Key; ComponentLink2Description: https://cdn.amphenol-icc.com/media/wysiwyg/files/drawing/67996.pdf?src-supplier=Digi-Key; ComponentLink3URL: https://cdn.amphenol-icc.com/media/wysiwyg/files/drawing/67996.pdf?src-supplier=Mouser; ComponentLink3Description: https://cdn.amphenol-icc.com/media/wysiwyg/files/drawing/67996.pdf?src-supplier=Mouser; ComponentLink4URL: https://cdn.amphenol-icc.com/media/wysiwyg/files/drawing/67996.pdf?src-supplier=Avnet+Europe; ComponentLink4Description: https://cdn.amphenol-icc.com/media/wysiwyg/files/drawing/67996.pdf?src-supplier=Avnet+Europe; Supplier Part Number 1: 609-3393-ND
R22 R23 R25 R26 = RC0603FR-0722RL: Res Thick Film 0603 22 Ohm 1% 0.1W(1/10W) ±100ppm/C Pad SMD T/R; Manufacturer: Yageo; Temperature Coefficient: 100ppm/°C; Voltage Rating (DC): 50V; Power Rating: 100mW; Supplier 1: Digi-Key; Manufacturer Part Number: RC0603FR-0722RL; Stock 1: 736588; Pricing 1: 1=0.1, 10=0.023, 100=0.0094, 1000=0.00421, 2500=0.00366 (USD); Case/Package: 0603; Number of Pins: 2; Case Code (Metric): 1608; Case Code (Imperial): 0603; Min Operating Temperature: -55°C; Max Operating Temperature: 155°C; Tolerance: 1%; Resistance: 22R; Composition: Thick Film; Packaging: Tape and Reel; Voltage Rating: 50V; Package Quantity: 1; Number of Terminations: 2; Termination: SMD/SMT; Military Standard: Not; Max Power Dissipation: 100mW; Features: Moisture Resistant; Length: 1.6mm; Height: 0.022inch; Width: 0.031inch; Depth: 0.8mm; REACH SVHC: No SVHC; Lead Free: Lead Free; ComponentLink1URL: http://www.yageo.com/documents/recent/PYu-RC_Group_51_RoHS_L_10.pdf?src-supplier=Digi-Key; ComponentLink1Description: http://www.yageo.com/documents/recent/PYu-RC_Group_51_RoHS_L_10.pdf?src-supplier=Digi-Key; ComponentLink2URL: http://documents.rs-components.com/techlib://itc_doclist_GB.htm?stockno=5050369&src-supplier=RSComponents; ComponentLink2Description: http://documents.rs-components.com/techlib://itc_doclist_GB.htm?stockno=5050369&src-supplier=RSComponents; ComponentLink3URL: http://www.farnell.com/datasheets/2167052.pdf?src-supplier=Element14; ComponentLink3Description: http://www.farnell.com/datasheets/2167052.pdf?src-supplier=Element14; ComponentLink4URL: http://www.farnell.com/datasheets/443971.pdf?src-supplier=Element14; ComponentLink4Description: http://www.farnell.com/datasheets/443971.pdf?src-supplier=Element14; Supplier Part Number 1: 311-22.0HRCT-ND
R24 R28 R30 = RC0603FR-0715KL: as R16 on sheet [01] - POWER; Supplier 1: Digi-Key; Manufacturer Part Number: RC0603FR-0715KL; Stock 1: 3342455; Pricing 1: 1=0.1, 10=0.023, 100=0.0094, 1000=0.00421, 2500=0.00366 (USD); Case/Package: 0603; Number of Pins: 2; Case Code (Metric): 1608; Case Code (Imperial): 0603; Min Operating Temperature: -55°C; Max Operating Temperature: 155°C; Tolerance: 1%; Composition: Thick Film; Packaging: Tape and Reel; Package Quantity: 1; Voltage Rating: 50V; Number of Terminations: 2; Termination: SMD/SMT; Military Standard: Not; Max Power Dissipation: 100mW; Features: Moisture Resistant; Length: 1.6mm; Height: 0.022inch; Width: 0.031inch; Depth: 0.8mm; Lead Free: Lead Free; REACH SVHC: Unknown; ComponentLink1URL: http://www.yageo.com/documents/recent/PYu-RC_Group_51_RoHS_L_10.pdf?src-supplier=Digi-Key; ComponentLink1Description: http://www.yageo.com/documents/recent/PYu-RC_Group_51_RoHS_L_10.pdf?src-supplier=Digi-Key; ComponentLink2URL: http://www.yageo.com/documents/recent/PYu-RC_Group_51_RoHS_L_9.pdf?src-supplier=Digi-Key; ComponentLink2Description: http://www.yageo.com/documents/recent/PYu-RC_Group_51_RoHS_L_9.pdf?src-supplier=Digi-Key; ComponentLink3URL: https://www.verical.com/server-webapp/html/getDatasheet?partID=327895&src-supplier=Verical; ComponentLink3Description: https://www.verical.com/server-webapp/html/getDatasheet?partID=327895&src-supplier=Verical; Supplier Part Number 1: 311-15.0KHRCT-ND
R27 R29 = RC0603FR-071K1L: RES SMD 1.1K OHM 1% 1/10W 0603; Manufacturer: Yageo; Power Rating: 100mW; Temperature Coefficient: 100ppm/°C; Resistance: 1.1kR; Voltage Rating: 50V; Supplier 1: Digi-Key; Manufacturer Part Number: RC0603FR-071K1L; Stock 1: 534181; Pricing 1: 1=0.1, 10=0.023, 100=0.0094, 1000=0.00421, 2500=0.00366 (USD); Case/Package: 0603; Number of Pins: 2; Case Code (Metric): 1608; Case Code (Imperial): 0603; Min Operating Temperature: -55°C; Max Operating Temperature: 155°C; Tolerance: 1%; Package Quantity: 1; Packaging: Tape and Reel; Composition: Thick Film; Number of Terminations: 2; Termination: SMD/SMT; Military Standard: Not; Max Power Dissipation: 100mW; Voltage Rating (DC): 50V; Features: Moisture Resistant; Length: 1.6mm; Height: 0.022inch; Depth: 0.8mm; Width: 0.031inch; REACH SVHC: No SVHC; Lead Free: Lead Free; ComponentLink1URL: http://www.yageo.com/documents/recent/PYu-RC_Group_51_RoHS_L_10.pdf?src-supplier=Digi-Key; ComponentLink1Description: http://www.yageo.com/documents/recent/PYu-RC_Group_51_RoHS_L_10.pdf?src-supplier=Digi-Key; ComponentLink2URL: http://www.yageo.com/documents/recent/PYu-RC_Group_51_RoHS_L_9.pdf?src-supplier=Digi-Key; ComponentLink2Description: http://www.yageo.com/documents/recent/PYu-RC_Group_51_RoHS_L_9.pdf?src-supplier=Digi-Key; Supplier Part Number 1: 311-1.10KHRDKR-ND
U1 = LFE5UM-45F-6BG381C: as U1 on sheet [01] - POWER; Supplier 1: Digi-Key; Manufacturer Part Number: LFE5UM-45F-6BG381C; Stock 1: 0; Pricing 1: 90=19.13967 (USD); Mount: Surface Mount; Case/Package: FBGA; Min Operating Temperature: 0°C; Max Operating Temperature: 85°C; Lead Free: Lead Free; ComponentLink1URL: http://www.latticesemi.com/~/media/LatticeSemi/Documents/DataSheets/ECP5/DS1044.pdf?src-supplier=Digi-Key; ComponentLink1Description: http://www.latticesemi.com/~/media/LatticeSemi/Documents/DataSheets/ECP5/DS1044.pdf?src-supplier=Digi-Key; Supplier Part Number 1: 220-1994-ND
U7 = FT231XS-R: FTDI - FT231XS-R - USB Interface, Transceiver, USB 2.0, 2.97 V, 5.5 V, SSOP, 20 RoHS Compliant: Yes; Max Supply Voltage: 5.5V; Min Supply Voltage: 2.97V; Number of Channels: 1; Operating Supply Voltage: 5V; Data Rate: 12Mbps; Interface: UART,USB; Operating Supply Current: 8mA; Supplier 1: Digi-Key; Manufacturer: FTDI; Manufacturer Part Number: FT231XS-R; Stock 1: 6035; Pricing 1: 1=2.12, 25=2.05, 100=1.98, 250=1.78, 500=1.6, 1000=1.55 (USD); Mount: Surface Mount; Case/Package: SSOP; Number of Pins: 20; Weight: 0.016oz; Min Operating Temperature: -40°C; Max Operating Temperature: 85°C; Packaging: Tape and Reel; Package Quantity: 2000; Length: 8.74mm; Height: 0.059inch; Width: 0.157inch; Radiation Hardening: No; ComponentLink1URL: http://uk.rs-online.com/webdocs/1102/0900766b811020d3.pdf?src-supplier=RSComponents; ComponentLink1Description: http://uk.rs-online.com/webdocs/1102/0900766b811020d3.pdf?src-supplier=RSComponents; ComponentLink2URL: https://media.digikey.com/pdf/Data%20Sheets/FTDI%20Chip%20PDFs/X-Chip_Series_Errata.pdf?src-supplier=Digi-Key; ComponentLink2Description: https://media.digikey.com/pdf/Data%20Sheets/FTDI%20Chip%20PDFs/X-Chip_Series_Errata.pdf?src-supplier=Digi-Key; ComponentLink3URL: http://www.ftdichip.com/Support/Documents/DataSheets/ICs/DS_FT231X.pdf?src-supplier=Digi-Key; ComponentLink3Description: http://www.ftdichip.com/Support/Documents/DataSheets/ICs/DS_FT231X.pdf?src-supplier=Digi-Key; ComponentLink4URL: http://www.alliedelec.com/images/products/datasheets/bm/FTDI/70403932.pdf?src-supplier=Allied+Electronics; ComponentLink4Description: http://www.alliedelec.com/images/products/datasheets/bm/FTDI/70403932.pdf?src-supplier=Allied+Electronics; Supplier Part Number 1: 768-1129-6-ND
Y1 = FNETHE025: SMD Crystal Oscillator 25MHz 3.3V 15pF 4-Pin CSMD; Manufacturer: Diodes; Frequency Stability: 25ppm; Max Supply Voltage: 3.63V; Min Supply Voltage: 2.97V; Max Supply Current: 15mA; Supplier 1: Digi-Key; Manufacturer Part Number: FNETHE025; Stock 1: 7023; Pricing 1: 1=1.1, 10=0.97, 50=0.9068, 100=0.8014, 500=0.75924 (USD); Mount: Surface Mount; Case/Package: CSMD; Number of Pins: 4; Min Operating Temperature: -20°C; Max Operating Temperature: 70°C; Frequency: 25MHz; Load Capacitance: 15pF; Operating Supply Voltage: 3.3V; Packaging: Tape and Reel; Package Quantity: 1000; Termination: SMD/SMT; Length: 7mm; Height: 0.061inch; Width: 0.197inch; Depth: 5mm; Radiation Hardening: No; Lead Free: Lead Free; ComponentLink1URL: http://www.pericom.com/assets/Datasheets/FNETHE025.pdf?src-supplier=Avnet+Europe; ComponentLink1Description: http://www.pericom.com/assets/Datasheets/FNETHE025.pdf?src-supplier=Avnet+Europe; ComponentLink2URL: https://www.verical.com/server-webapp/html/getDatasheet?partID=362555&src-supplier=Verical; ComponentLink2Description: https://www.verical.com/server-webapp/html/getDatasheet?partID=362555&src-supplier=Verical; ComponentLink3URL: http://www.pericom.com/assets/Datasheets/FNETHE025-Rev-E.pdf?src-supplier=Future+Electronics; ComponentLink3Description: http://www.pericom.com/assets/Datasheets/FNETHE025-Rev-E.pdf?src-supplier=Future+Electronics; ComponentLink4URL: https://www.diodes.com/assets/Datasheets/FNETHE025.pdf?src-supplier=Digi-Key; ComponentLink4Description: https://www.diodes.com/assets/Datasheets/FNETHE025.pdf?src-supplier=Digi-Key; ComponentLink5URL: https://media.digikey.com/pdf/Data%20Sheets/Diodes%20PDFs/FNETHE025.pdf?src-supplier=Digi-Key; ComponentLink5Description: https://media.digikey.com/pdf/Data%20Sheets/Diodes%20PDFs/FNETHE025.pdf?src-supplier=Digi-Key; ComponentLink6URL: http://www.pericom.com/assets/Datasheets/FNETHE025.pdf?src-supplier=Avnet; ComponentLink6Description: http://www.pericom.com/assets/Datasheets/FNETHE025.pdf?src-supplier=Avnet; Supplier Part Number 1: FNETHE025DKR-ND

## Sheet [03] - SDCARD.SchDoc
size A3
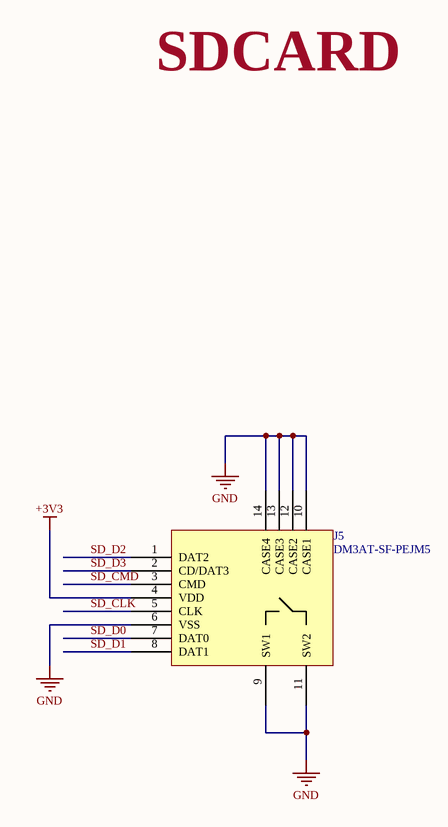
[diagram p2: [03] - SDCARD.SchDoc]

### Parts
J5  DM3AT-SF-PEJM5  [uSD_DM3AT]

### Nets
+3V3: J5.4(VDD)
GND: J5.6(VSS) J5.9(SW1) J5.10(CASE1) J5.11(SW2) J5.12(CASE2) J5.13(CASE3) J5.14(CASE4)
SD_CLK: J5.5(CLK)
SD_CMD: J5.3(CMD)
SD_D0: J5.7(DAT0)
SD_D1: J5.8(DAT1)
SD_D2: J5.1(DAT2)
SD_D3: J5.2(CD/DAT3)

### Notes on the sheet
- SDCARD

### Library data of the parts
J5 = DM3AT-SF-PEJM5: CONN MICRO SD R/A PUSH-PUSH SMD; Manufacturer: Hirose Electric Co Ltd; .Checked PCB: MM; Connector Type: Connector and Ejector; Card Type: Secure Digital - microSD TransFlash; Number of Positions: 10 (8 + 2); Insertion, Removal Method: Push In, Push Out; .Checked SCH: MM; Category: Connectors, Interconnects; Supplier Part Number: HR1964CT-ND; Family: Memory - PC Card Connectors; Manufacturer Part Number: DM3AT-SF-PEJM5; Price 1k [$]: 1.85200; Supplier: Digikey; Supplier 1: Digi-Key; Supplier Part Number 1: HR1964CT-ND; RoHS: RoHS Compliant; Stock 1: 7044; Pricing 1: 1=2.96, 10=2.457, 50=2.0476, 100=1.82, 250=1.5106, 500=1.365 (USD); Ejector Side: -; Mounting Type: Surface Mount, Right Angle; Features: Switch; Height Above Board: 0.066" (1.68mm); Mounting Feature: Normal, Standard - Top; Packaging: Cut Tape (CT); Contact Finish: Gold; Contact Finish Thickness: -; ComponentLink1URL: http://www.hirose.co.jp/cataloge_hp/e60900232.pdf; ComponentLink1Description: http://www.hirose.co.jp/cataloge_hp/e60900232.pdf

## Sheet [04] - RAM.SchDoc
size A3
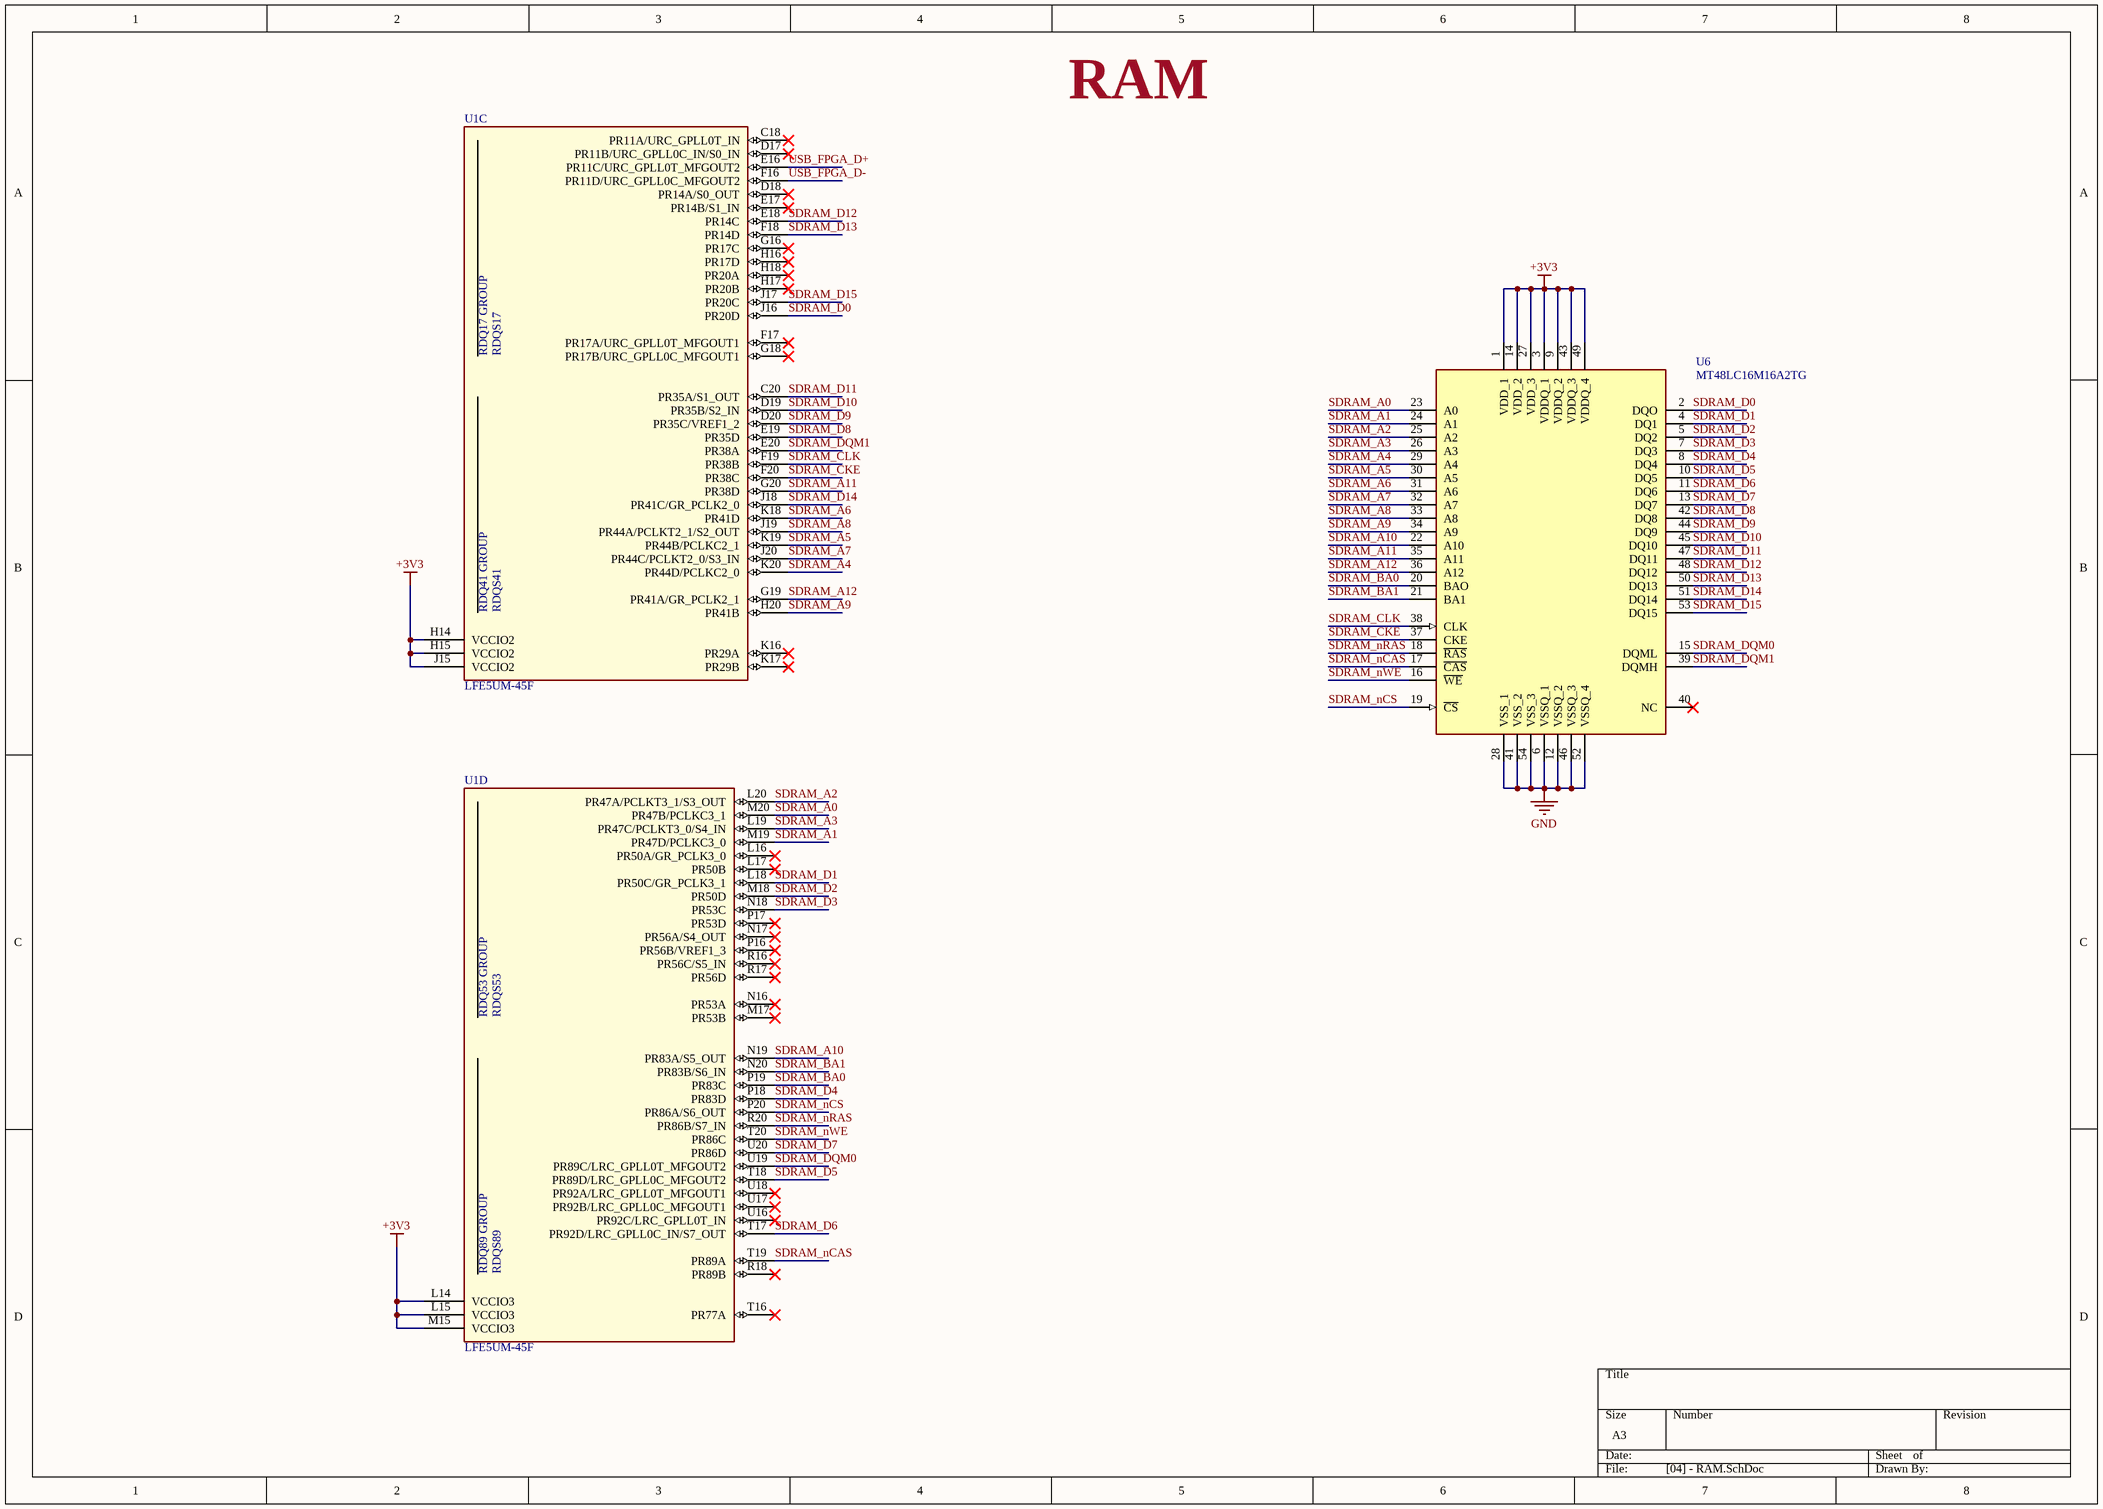
[diagram p3: [04] - RAM.SchDoc]

### Parts
U1  LFE5UM-45F  [LFE5BG381]  (parts C,D of 11)
U6  MT48LC16M16A2TG  [SOP80P1176X120-54N]

### Nets
+3V3: U1.H14(VCCIO2) U1.H15(VCCIO2) U1.J15(VCCIO2) U1.L14(VCCIO3) U1.L15(VCCIO3) U1.M15(VCCIO3) U6.1(VDD_1) U6.3(VDDQ_1) U6.9(VDDQ_2) U6.14(VDD_2) U6.27(VDD_3) U6.43(VDDQ_3) U6.49(VDDQ_4)
GND: U6.6(VSSQ_1) U6.12(VSSQ_2) U6.28(VSS_1) U6.41(VSS_2) U6.46(VSSQ_3) U6.52(VSSQ_4) U6.54(VSS_3)
SDRAM_A0: U1.M20(PR47B/PCLKC3_1) U6.23(A0)
SDRAM_A1: U1.M19(PR47D/PCLKC3_0) U6.24(A1)
SDRAM_A2: U1.L20(PR47A/PCLKT3_1/S3_OUT) U6.25(A2)
SDRAM_A3: U1.L19(PR47C/PCLKT3_0/S4_IN) U6.26(A3)
SDRAM_A4: U1.K20(PR44D/PCLKC2_0) U6.29(A4)
SDRAM_A5: U1.K19(PR44B/PCLKC2_1) U6.30(A5)
SDRAM_A6: U1.K18(PR41D) U6.31(A6)
SDRAM_A7: U1.J20(PR44C/PCLKT2_0/S3_IN) U6.32(A7)
SDRAM_A8: U1.J19(PR44A/PCLKT2_1/S2_OUT) U6.33(A8)
SDRAM_A9: U1.H20(PR41B) U6.34(A9)
SDRAM_A10: U1.N19(PR83A/S5_OUT) U6.22(A10)
SDRAM_A11: U1.G20(PR38D) U6.35(A11)
SDRAM_A12: U1.G19(PR41A/GR_PCLK2_1) U6.36(A12)
SDRAM_BA0: U1.P19(PR83C) U6.20(BAO)
SDRAM_BA1: U1.N20(PR83B/S6_IN) U6.21(BA1)
SDRAM_CKE: U1.F20(PR38C) U6.37(CKE)
SDRAM_CLK: U1.F19(PR38B) U6.38(CLK)
SDRAM_D0: U1.J16(PR20D) U6.2(DQO)
SDRAM_D1: U1.L18(PR50C/GR_PCLK3_1) U6.4(DQ1)
SDRAM_D2: U1.M18(PR50D) U6.5(DQ2)
SDRAM_D3: U1.N18(PR53C) U6.7(DQ3)
SDRAM_D4: U1.P18(PR83D) U6.8(DQ4)
SDRAM_D5: U1.T18(PR89D/LRC_GPLL0C_MFGOUT2) U6.10(DQ5)
SDRAM_D6: U1.T17(PR92D/LRC_GPLL0C_IN/S7_OUT) U6.11(DQ6)
SDRAM_D7: U1.U20(PR86D) U6.13(DQ7)
SDRAM_D8: U1.E19(PR35D) U6.42(DQ8)
SDRAM_D9: U1.D20(PR35C/VREF1_2) U6.44(DQ9)
SDRAM_D10: U1.D19(PR35B/S2_IN) U6.45(DQ10)
SDRAM_D11: U1.C20(PR35A/S1_OUT) U6.47(DQ11)
SDRAM_D12: U1.E18(PR14C) U6.48(DQ12)
SDRAM_D13: U1.F18(PR14D) U6.50(DQ13)
SDRAM_D14: U1.J18(PR41C/GR_PCLK2_0) U6.51(DQ14)
SDRAM_D15: U1.J17(PR20C) U6.53(DQ15)
SDRAM_DQM0: U1.U19(PR89C/LRC_GPLL0T_MFGOUT2) U6.15(DQML)
SDRAM_DQM1: U1.E20(PR38A) U6.39(DQMH)
SDRAM_nCAS: U1.T19(PR89A) U6.17(~{CAS})
SDRAM_nCS: U1.P20(PR86A/S6_OUT) U6.19(~{CS})
SDRAM_nRAS: U1.R20(PR86B/S7_IN) U6.18(~{RAS})
SDRAM_nWE: U1.T20(PR86C) U6.16(~{WE})
USB_FPGA_D+: U1.E16(PR11C/URC_GPLL0T_MFGOUT2)
USB_FPGA_D-: U1.F16(PR11D/URC_GPLL0C_MFGOUT2)

Not connected (* = marked no-connect by the designer): U1 C18(PR11A/URC_GPLL0T_IN)* D17(PR11B/URC_GPLL0C_IN/S0_IN)* D18(PR14A/S0_OUT)* E17(PR14B/S1_IN)* F17(PR17A/URC_GPLL0T_MFGOUT1)* G16(PR17C)* G18(PR17B/URC_GPLL0C_MFGOUT1)* H16(PR17D)* H17(PR20B)* H18(PR20A)* K16(PR29A)* K17(PR29B)* L16(PR50A/GR_PCLK3_0)* L17(PR50B)* M17(PR53B)* N16(PR53A)* N17(PR56A/S4_OUT)* P16(PR56B/VREF1_3)* P17(PR53D)* R16(PR56C/S5_IN)* R17(PR56D)* R18(PR89B)* T16(PR77A)* U16(PR92C/LRC_GPLL0T_IN)* U17(PR92B/LRC_GPLL0C_MFGOUT1)* U18(PR92A/LRC_GPLL0T_MFGOUT1)*; U6 40(NC)*

### Notes on the sheet
- RAM
- (in symbol LFE5UM-45F-6BG381C, part C) RDQ17 GROUP; RDQS17; RDQ41 GROUP; RDQS41
- (in symbol LFE5UM-45F-6BG381C, part D) RDQ53 GROUP; RDQS53; RDQ89 GROUP; RDQS89

### Library data of the parts
U1 = LFE5UM-45F-6BG381C: as U1 on sheet [01] - POWER; Supplier 1: Digi-Key; Manufacturer Part Number: LFE5UM-45F-6BG381C; Stock 1: 0; Pricing 1: 90=19.13967 (USD); Mount: Surface Mount; Case/Package: FBGA; Min Operating Temperature: 0°C; Max Operating Temperature: 85°C; Lead Free: Lead Free; ComponentLink1URL: http://www.latticesemi.com/~/media/LatticeSemi/Documents/DataSheets/ECP5/DS1044.pdf?src-supplier=Digi-Key; ComponentLink1Description: http://www.latticesemi.com/~/media/LatticeSemi/Documents/DataSheets/ECP5/DS1044.pdf?src-supplier=Digi-Key; Supplier Part Number 1: 220-1994-ND
U6 = MT48LC16M16A2TG-6A:GTR: IC Dram 256M Parallel 54TSOP; Manufacturer: Alliance Memory; Access Time: 5.4ns; Frequency: 167MHz; Memory Type: Volatile; Memory Size: 256Mb; Supplier 1: Digi-Key; Manufacturer Part Number: MT48LC16M16A2TG-6A:GTR; Stock 1: 0; Mount: Surface Mount; Case/Package: TSOP; Number of Pins: 54; Min Operating Temperature: 0°C; Max Operating Temperature: 70°C; Packaging: Cut Tape; Supplier Part Number 1: 1450-1352-6-ND